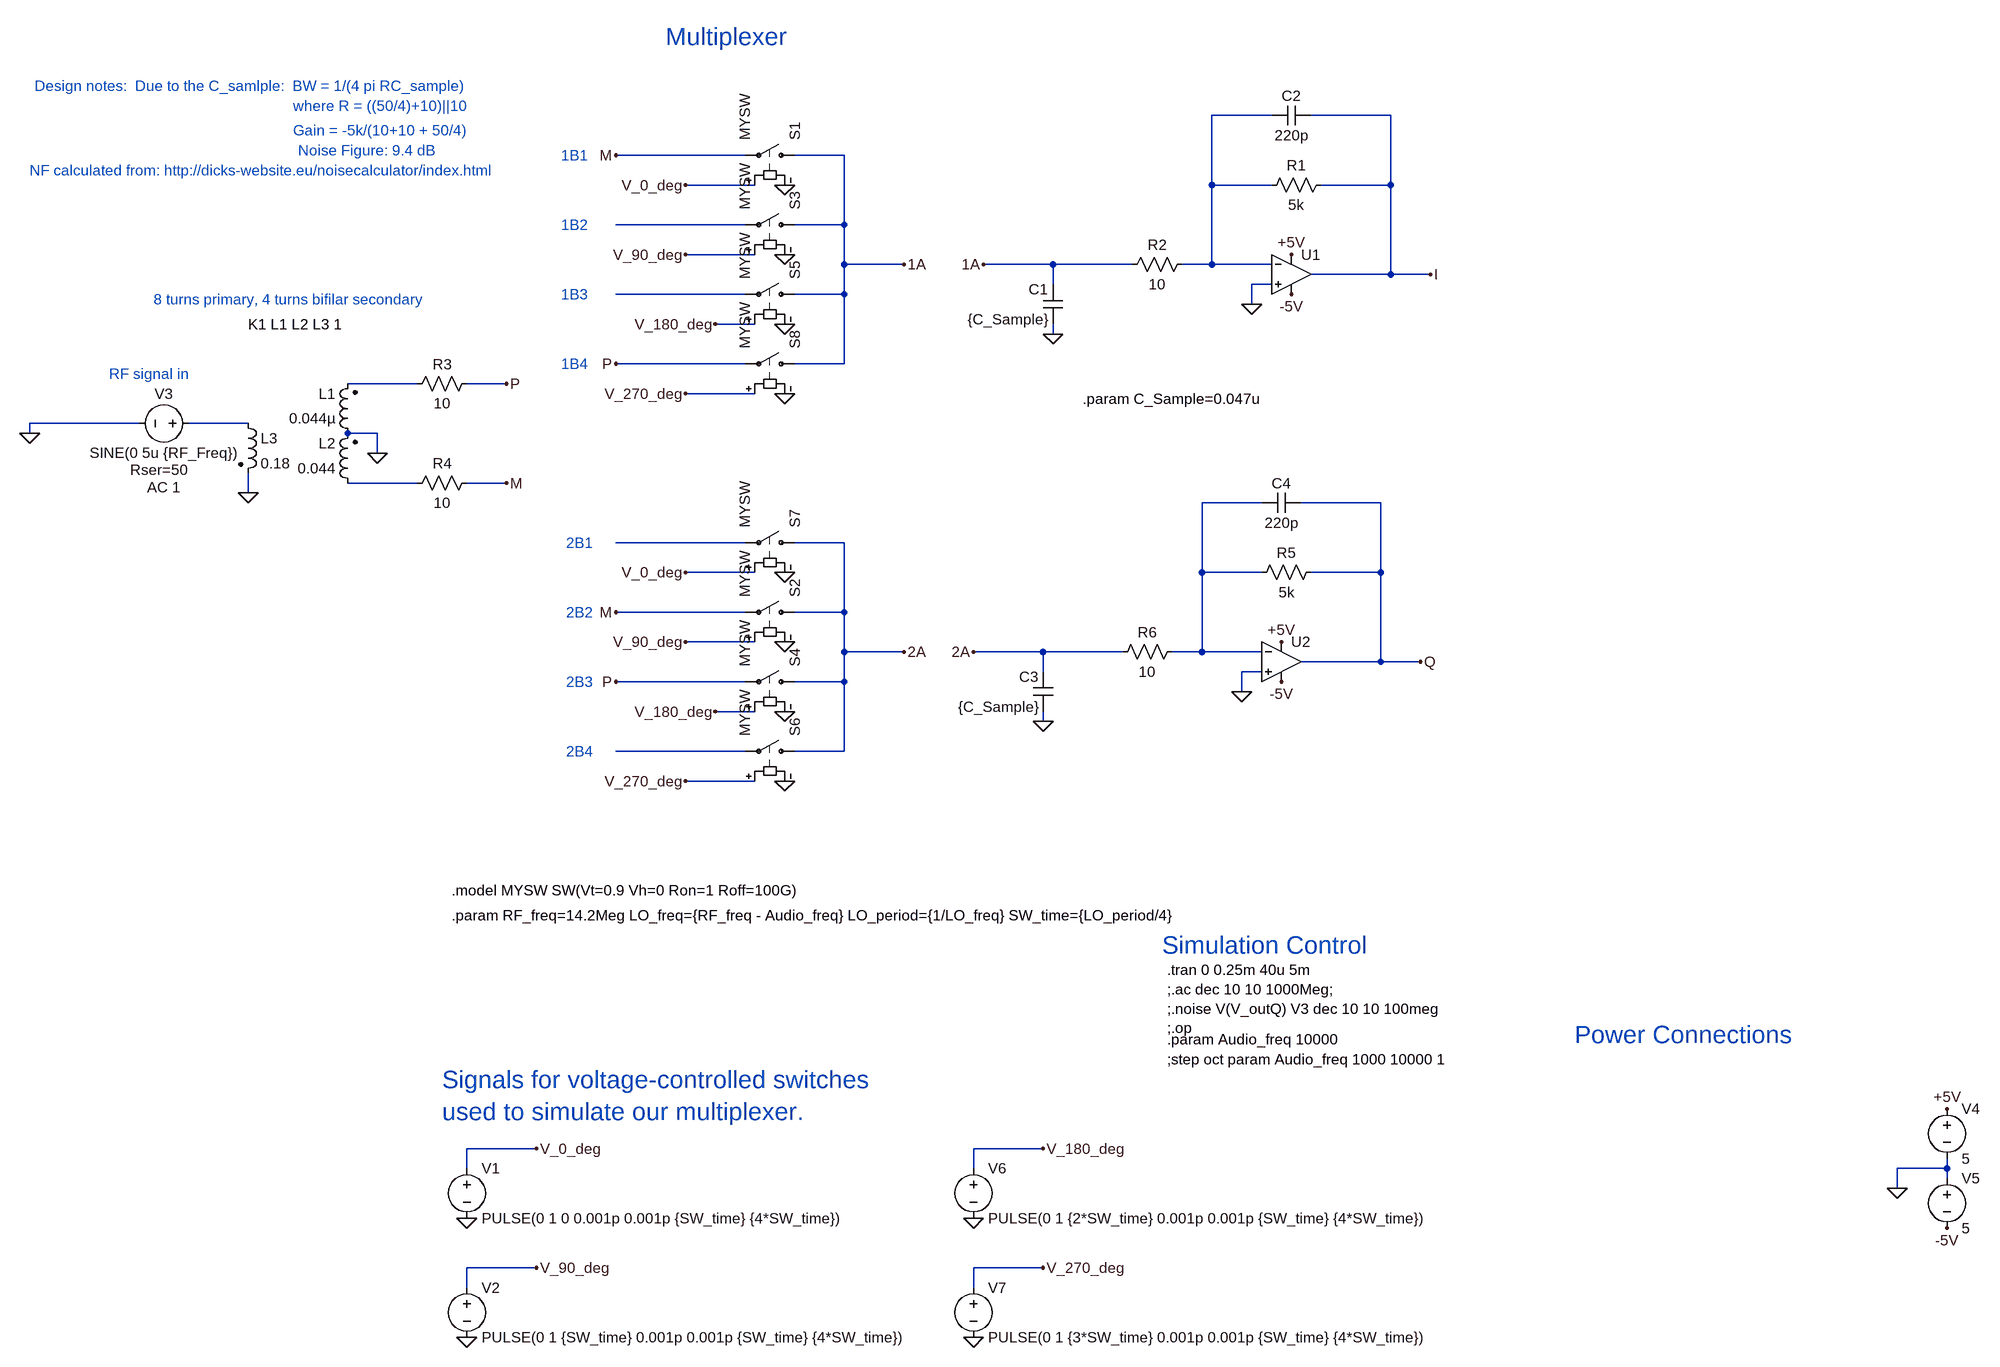
[diagram p0: schematic TayloeDetectorSoftrockAmplifier.asc]
TayloeDetectorSoftrockAmplifier.asc, the LTspice schematic file:
Version 4
SHEET 1 3200 1748
WIRE 560 -864 464 -864
WIRE 752 -864 624 -864
WIRE -288 -800 -496 -800
WIRE -128 -800 -208 -800
WIRE -272 -752 -384 -752
WIRE 464 -752 464 -864
WIRE 560 -752 464 -752
WIRE 752 -752 752 -864
WIRE 752 -752 640 -752
WIRE -288 -688 -496 -688
WIRE -128 -688 -128 -800
WIRE -128 -688 -208 -688
WIRE -272 -640 -384 -640
WIRE -128 -624 -128 -688
WIRE -32 -624 -128 -624
WIRE 208 -624 96 -624
WIRE 336 -624 208 -624
WIRE 464 -624 464 -752
WIRE 464 -624 416 -624
WIRE 560 -624 464 -624
WIRE 752 -608 752 -752
WIRE 752 -608 624 -608
WIRE 816 -608 752 -608
WIRE 208 -592 208 -624
WIRE 560 -592 528 -592
WIRE -288 -576 -496 -576
WIRE -128 -576 -128 -624
WIRE -128 -576 -208 -576
WIRE 528 -560 528 -592
WIRE -272 -528 -336 -528
WIRE 208 -512 208 -528
WIRE -288 -464 -496 -464
WIRE -128 -464 -128 -576
WIRE -128 -464 -208 -464
WIRE -816 -432 -928 -432
WIRE -672 -432 -736 -432
WIRE -272 -416 -384 -416
WIRE -1264 -368 -1440 -368
WIRE -1088 -368 -1184 -368
WIRE -1440 -352 -1440 -368
WIRE -880 -352 -928 -352
WIRE -880 -320 -880 -352
WIRE -816 -272 -928 -272
WIRE -672 -272 -736 -272
WIRE -1088 -256 -1088 -288
WIRE 544 -240 448 -240
WIRE 736 -240 608 -240
WIRE -288 -176 -496 -176
WIRE -128 -176 -208 -176
WIRE -272 -128 -384 -128
WIRE 448 -128 448 -240
WIRE 544 -128 448 -128
WIRE 736 -128 736 -240
WIRE 736 -128 624 -128
WIRE -288 -64 -496 -64
WIRE -128 -64 -128 -176
WIRE -128 -64 -208 -64
WIRE -272 -16 -384 -16
WIRE -128 0 -128 -64
WIRE -32 0 -128 0
WIRE 192 0 80 0
WIRE 320 0 192 0
WIRE 448 0 448 -128
WIRE 448 0 400 0
WIRE 544 0 448 0
WIRE 736 16 736 -128
WIRE 736 16 608 16
WIRE 800 16 736 16
WIRE 192 32 192 0
WIRE 544 32 512 32
WIRE -288 48 -496 48
WIRE -128 48 -128 0
WIRE -128 48 -208 48
WIRE 512 64 512 32
WIRE -272 96 -336 96
WIRE 192 112 192 96
WIRE -288 160 -496 160
WIRE -128 160 -128 48
WIRE -128 160 -208 160
WIRE -272 208 -384 208
WIRE -624 800 -736 800
WIRE 192 800 80 800
WIRE -736 832 -736 800
WIRE 80 832 80 800
WIRE 1648 832 1648 816
WIRE 1648 832 1568 832
WIRE 1648 848 1648 832
WIRE 1568 864 1568 832
WIRE -624 992 -736 992
WIRE 192 992 80 992
WIRE -736 1024 -736 992
WIRE 80 1024 80 992
FLAG -224 -128 0
FLAG -224 -16 0
FLAG -224 96 0
FLAG -224 208 0
FLAG -1440 -352 0
FLAG 1648 736 +5V
FLAG 1568 864 0
FLAG 1648 928 -5V
FLAG -384 -128 V_0_deg
FLAG -384 -16 V_90_deg
FLAG -336 96 V_180_deg
FLAG -384 208 V_270_deg
FLAG -736 912 0
FLAG -624 800 V_0_deg
FLAG -736 1104 0
FLAG -624 992 V_90_deg
FLAG 80 912 0
FLAG 192 800 V_180_deg
FLAG 80 1104 0
FLAG 192 992 V_270_deg
FLAG 208 -512 0
FLAG -1088 -256 0
FLAG -224 -752 0
FLAG -224 -640 0
FLAG -224 -528 0
FLAG -224 -416 0
FLAG -384 -752 V_0_deg
FLAG -384 -640 V_90_deg
FLAG -336 -528 V_180_deg
FLAG -384 -416 V_270_deg
FLAG -496 -464 P
FLAG -496 48 P
FLAG -496 -800 M
FLAG -496 -64 M
FLAG -32 -624 1A
FLAG 96 -624 1A
FLAG -32 0 2A
FLAG -672 -432 P
FLAG -672 -272 M
FLAG 192 112 0
FLAG 576 -16 +5V
FLAG 576 48 -5V
FLAG 512 64 0
FLAG 80 0 2A
FLAG 816 -608 I
FLAG 800 16 Q
FLAG -880 -320 0
FLAG 592 -640 +5V
FLAG 592 -576 -5V
FLAG 528 -560 0
SYMBOL sw -192 -176 M270
SYMATTR InstName S7
SYMATTR Value MYSW
SYMBOL sw -192 -64 M270
SYMATTR InstName S2
SYMATTR Value MYSW
SYMBOL sw -192 48 M270
SYMATTR InstName S4
SYMATTR Value MYSW
SYMBOL sw -192 160 M270
SYMATTR InstName S6
SYMATTR Value MYSW
SYMBOL voltage -1168 -368 R90
WINDOW 0 -32 56 VBottom 2
WINDOW 3 32 56 VTop 2
WINDOW 123 118 56 VBottom 2
WINDOW 39 90 64 VBottom 2
SYMATTR InstName V3
SYMATTR Value SINE(0 5u {RF_Freq})
SYMATTR Value2 AC 1
SYMATTR SpiceLine Rser=50
SYMBOL voltage 1648 720 R0
WINDOW 123 0 0 Left 0
WINDOW 39 0 0 Left 0
SYMATTR InstName V4
SYMATTR Value 5
SYMBOL voltage 1648 832 R0
WINDOW 123 0 0 Left 0
WINDOW 39 0 0 Left 0
SYMATTR InstName V5
SYMATTR Value 5
SYMBOL voltage -736 816 R0
WINDOW 123 0 0 Left 0
WINDOW 39 0 0 Left 0
SYMATTR InstName V1
SYMATTR Value PULSE(0 1 0 0.001p 0.001p {SW_time} {4*SW_time})
SYMBOL voltage -736 1008 R0
WINDOW 123 0 0 Left 0
WINDOW 39 0 0 Left 0
SYMATTR InstName V2
SYMATTR Value PULSE(0 1 {SW_time} 0.001p 0.001p {SW_time} {4*SW_time})
SYMBOL voltage 80 816 R0
WINDOW 123 0 0 Left 0
WINDOW 39 0 0 Left 0
SYMATTR InstName V6
SYMATTR Value PULSE(0 1 {2*SW_time} 0.001p 0.001p {SW_time} {4*SW_time})
SYMBOL voltage 80 1008 R0
WINDOW 123 0 0 Left 0
WINDOW 39 0 0 Left 0
SYMATTR InstName V7
SYMATTR Value PULSE(0 1 {3*SW_time} 0.001p 0.001p {SW_time} {4*SW_time})
SYMBOL cap 224 -528 R180
WINDOW 0 24 56 Left 2
WINDOW 3 24 8 Left 2
SYMATTR InstName C1
SYMATTR Value {C_Sample}
SYMBOL res 432 -640 R90
WINDOW 0 0 56 VBottom 2
WINDOW 3 32 56 VTop 2
SYMATTR InstName R2
SYMATTR Value 10
SYMBOL ind2 -912 -336 R180
WINDOW 0 36 80 Left 2
WINDOW 3 36 40 Left 2
SYMATTR InstName L1
SYMATTR Value 0.044µ
SYMATTR Type ind
SYMBOL ind2 -912 -256 R180
WINDOW 0 36 80 Left 2
WINDOW 3 36 40 Left 2
SYMATTR InstName L2
SYMATTR Value 0.044
SYMATTR Type ind
SYMBOL ind2 -1104 -384 R0
SYMATTR InstName L3
SYMATTR Value 0.18
SYMATTR Type ind
SYMBOL sw -192 -800 M270
SYMATTR InstName S1
SYMATTR Value MYSW
SYMBOL sw -192 -688 M270
SYMATTR InstName S3
SYMATTR Value MYSW
SYMBOL sw -192 -576 M270
SYMATTR InstName S5
SYMATTR Value MYSW
SYMBOL sw -192 -464 M270
SYMATTR InstName S8
SYMATTR Value MYSW
SYMBOL res -720 -448 R90
WINDOW 0 0 56 VBottom 2
WINDOW 3 32 56 VTop 2
SYMATTR InstName R3
SYMATTR Value 10
SYMBOL res -720 -288 R90
WINDOW 0 0 56 VBottom 2
WINDOW 3 32 56 VTop 2
SYMATTR InstName R4
SYMATTR Value 10
SYMBOL cap 208 96 R180
WINDOW 0 24 56 Left 2
WINDOW 3 24 8 Left 2
SYMATTR InstName C3
SYMATTR Value {C_Sample}
SYMBOL res 640 -144 R90
WINDOW 0 0 56 VBottom 2
WINDOW 3 32 56 VTop 2
SYMATTR InstName R5
SYMATTR Value 5k
SYMBOL Opamps\\UniversalOpamp2 576 16 R0
SYMATTR InstName U2
SYMATTR SpiceModel level.1
SYMATTR Value2 Avol=1Meg GBW=100Meg Slew=100Meg
SYMBOL res 416 -16 R90
WINDOW 0 0 56 VBottom 2
WINDOW 3 32 56 VTop 2
SYMATTR InstName R6
SYMATTR Value 10
SYMBOL cap 608 -256 R90
WINDOW 0 0 32 VBottom 2
WINDOW 3 32 32 VTop 2
SYMATTR InstName C4
SYMATTR Value 220p
SYMBOL res 656 -768 R90
WINDOW 0 0 56 VBottom 2
WINDOW 3 32 56 VTop 2
SYMATTR InstName R1
SYMATTR Value 5k
SYMBOL Opamps\\UniversalOpamp2 592 -608 R0
SYMATTR InstName U1
SYMATTR SpiceModel level.1
SYMATTR Value2 Avol=1Meg GBW=100Meg Slew=100Meg
SYMBOL cap 624 -880 R90
WINDOW 0 0 32 VBottom 2
WINDOW 3 32 32 VTop 2
SYMATTR InstName C2
SYMATTR Value 220p
TEXT -760 384 Left 2 !.model MYSW SW(Vt=0.9 Vh=0 Ron=1 Roff=100G)
TEXT 392 512 Left 2 !.tran 0 0.25m 40u 5m\n;.ac dec 10 10 1000Meg;\n;.noise V(V_outQ) V3 dec 10 10 100meg\n;.op
TEXT -760 424 Left 2 !.param RF_freq=14.2Meg LO_freq={RF_freq - Audio_freq} LO_period={1/LO_freq} SW_time={LO_period/4}
TEXT 256 -408 Left 2 !.param C_Sample=0.047u
TEXT -776 688 Left 4 ;Signals for voltage-controlled switches \nused to simulate our multiplexer.
TEXT 1048 616 Left 4 ;Power Connections
TEXT -1312 -448 Left 2 ;RF signal in
TEXT -416 -992 Left 4 ;Multiplexer
TEXT 384 472 Left 4 ;Simulation Control
TEXT 392 656 Left 2 !;step oct param Audio_freq 1000 10000 1
TEXT 392 624 Left 2 !.param Audio_freq 10000
TEXT -584 -800 Left 2 ;1B1
TEXT -584 -688 Left 2 ;1B2
TEXT -584 -576 Left 2 ;1B3
TEXT -584 -464 Left 2 ;1B4
TEXT -576 -176 Left 2 ;2B1
TEXT -576 -64 Left 2 ;2B2
TEXT -576 48 Left 2 ;2B3
TEXT -576 160 Left 2 ;2B4
TEXT -1088 -528 Left 2 !K1 L1 L2 L3 1
TEXT -1240 -568 Left 2 ;8 turns primary, 4 turns bifilar secondary
TEXT -1432 -912 Left 2 ;Design notes:  Due to the C_samlple:  BW = 1/(4 pi RC_sample)
TEXT -1016 -880 Left 2 ;where R = ((50/4)+10)||10
TEXT -1016 -840 Left 2 ;Gain = -5k/(10+10 + 50/4)
TEXT -1008 -808 Left 2 ;Noise Figure: 9.4 dB
TEXT -1440 -776 Left 2 ;NF calculated from: http://dicks-website.eu/noisecalculator/index.html

The netlist it stands for:
* TayloeDetectorSoftrockAmplifier.asc
S7 2A N008 V_0_deg 0 MYSW
S2 2A M V_90_deg 0 MYSW
S4 2A P V_180_deg 0 MYSW
S6 2A N009 V_270_deg 0 MYSW
V3 N005 0 SINE(0 5u {RF_Freq}) AC 1 Rser=50
V4 +5V 0 5
V5 0 -5V 5
V1 V_0_deg 0 PULSE(0 1 0 0.001p 0.001p {SW_time} {4*SW_time})
V2 V_90_deg 0 PULSE(0 1 {SW_time} 0.001p 0.001p {SW_time} {4*SW_time})
V6 V_180_deg 0 PULSE(0 1 {2*SW_time} 0.001p 0.001p {SW_time} {4*SW_time})
V7 V_270_deg 0 PULSE(0 1 {3*SW_time} 0.001p 0.001p {SW_time} {4*SW_time})
C1 0 1A {C_Sample}
R2 N001 1A 10
L1 0 N004 0.044µ
L2 N006 0 0.044
L3 N005 0 0.18
S1 1A M V_0_deg 0 MYSW
S3 1A N002 V_90_deg 0 MYSW
S5 1A N003 V_180_deg 0 MYSW
S8 1A P V_270_deg 0 MYSW
R3 P N004 10
R4 M N006 10
C3 0 2A {C_Sample}
R5 Q N007 5k
XU2 0 N007 +5V -5V Q level.1 Avol=1Meg GBW=100Meg Slew=100Meg ilimit=25m rail=0 Vos=0 phimargin=45 en=0 enk=0 in=0 ink=0 Rin=500Meg  ; pins IN+ IN- V+ V- OUT
R6 N007 2A 10
C4 Q N007 220p
R1 I N001 5k
XU1 0 N001 +5V -5V I level.1 Avol=1Meg GBW=100Meg Slew=100Meg ilimit=25m rail=0 Vos=0 phimargin=45 en=0 enk=0 in=0 ink=0 Rin=500Meg  ; pins IN+ IN- V+ V- OUT
C2 I N001 220p
.model MYSW SW(Vt=0.9 Vh=0 Ron=1 Roff=100G)
.tran 0 0.25m 40u 5m
;.ac dec 10 10 1000Meg;
;.noise V(V_outQ) V3 dec 10 10 100meg
;.op
.param RF_freq=14.2Meg LO_freq={RF_freq - Audio_freq} LO_period={1/LO_freq} SW_time={LO_period/4}
.param C_Sample=0.047u
* Signals for voltage-controlled switches
* used to simulate our multiplexer.
* Power Connections
* RF signal in
* Multiplexer
* Simulation Control
;step oct param Audio_freq 1000 10000 1
.param Audio_freq 10000
* 1B1
* 1B2
* 1B3
* 1B4
* 2B1
* 2B2
* 2B3
* 2B4
K1 L1 L2 L3 1
* 8 turns primary, 4 turns bifilar secondary
* Design notes:  Due to the C_samlple:  BW = 1/(4 pi RC_sample)
* where R = ((50/4)+10)||10
* Gain = -5k/(10+10 + 50/4)
* Noise Figure: 9.4 dB
* NF calculated from: http://dicks-website.eu/noisecalculator/index.html
.lib UniversalOpamps2.sub
.backanno
.end